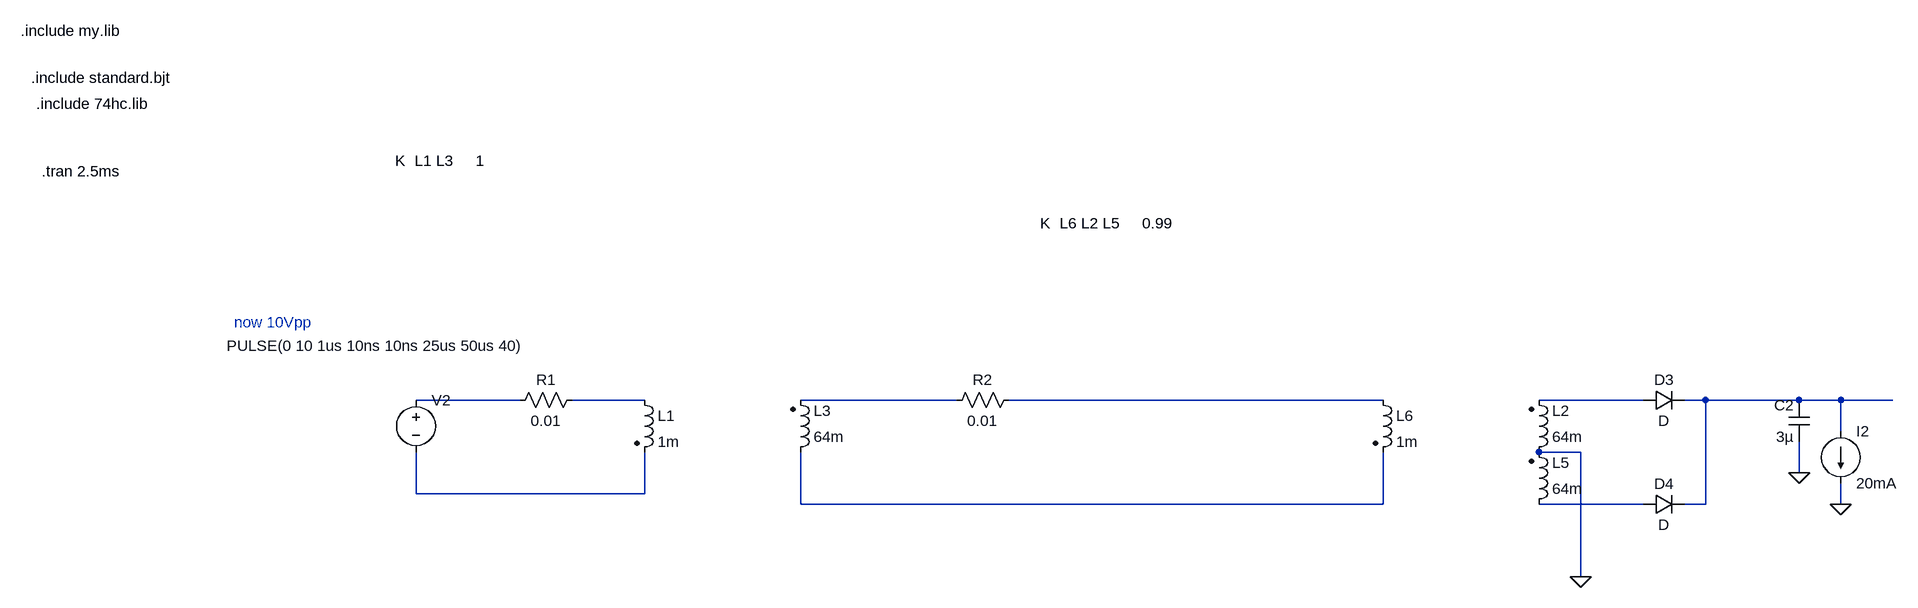
[diagram p0: schematic Draft200.asc]
Draft200.asc, the LTspice schematic file:
Version 4
SHEET 1 5720 1740
WIRE 1312 -128 1152 -128
WIRE 1504 -128 1392 -128
WIRE 1984 -128 1744 -128
WIRE 2640 -128 2064 -128
WIRE 3040 -128 2880 -128
WIRE 3136 -128 3104 -128
WIRE 3280 -128 3136 -128
WIRE 3344 -128 3280 -128
WIRE 3424 -128 3344 -128
WIRE 3344 -80 3344 -128
WIRE 2944 -48 2880 -48
WIRE 3280 -16 3280 -64
WIRE 1152 16 1152 -48
WIRE 1504 16 1504 -48
WIRE 1504 16 1152 16
WIRE 1744 32 1744 -48
WIRE 2640 32 2640 -48
WIRE 2640 32 1744 32
WIRE 3040 32 2880 32
WIRE 3136 32 3136 -128
WIRE 3136 32 3104 32
WIRE 3344 32 3344 0
WIRE 2944 144 2944 -48
FLAG 2944 144 0
FLAG 3280 -16 0
FLAG 3344 32 0
SYMBOL ind2 1728 -32 M180
WINDOW 0 36 80 Left 2
WINDOW 3 36 40 Left 2
SYMATTR InstName L3
SYMATTR Value 64m
SYMATTR Type ind
SYMBOL ind2 1488 -144 R0
SYMATTR InstName L1
SYMATTR Value 1m
SYMATTR Type ind
SYMBOL voltage 1152 -144 R0
WINDOW 123 0 0 Left 0
WINDOW 39 0 0 Left 0
WINDOW 3 -291 -68 Left 2
SYMATTR Value PULSE(0 10 1us 10ns 10ns 25us 50us 40)
SYMATTR InstName V2
SYMBOL res 1408 -144 R90
WINDOW 0 0 56 VBottom 2
WINDOW 3 32 56 VTop 2
SYMATTR InstName R1
SYMATTR Value 0.01
SYMBOL ind2 2864 -32 M180
WINDOW 0 36 80 Left 2
WINDOW 3 36 40 Left 2
SYMATTR InstName L2
SYMATTR Value 64m
SYMATTR Type ind
SYMBOL ind2 2864 48 M180
WINDOW 0 36 80 Left 2
WINDOW 3 36 40 Left 2
SYMATTR InstName L5
SYMATTR Value 64m
SYMATTR Type ind
SYMBOL ind2 2624 -144 R0
SYMATTR InstName L6
SYMATTR Value 1m
SYMATTR Type ind
SYMBOL cap 3296 -64 R180
WINDOW 0 24 56 Left 2
WINDOW 3 24 8 Left 2
SYMATTR InstName C2
SYMATTR Value 3µ
SYMBOL current 3344 -80 R0
WINDOW 123 0 0 Left 0
WINDOW 39 0 0 Left 0
SYMATTR InstName I2
SYMATTR Value 20mA
SYMBOL diode 3040 -112 R270
WINDOW 0 32 32 VTop 2
WINDOW 3 0 32 VBottom 2
SYMATTR InstName D3
SYMBOL diode 3040 48 R270
WINDOW 0 32 32 VTop 2
WINDOW 3 0 32 VBottom 2
SYMATTR InstName D4
SYMBOL res 2080 -144 R90
WINDOW 0 0 56 VBottom 2
WINDOW 3 32 56 VTop 2
SYMATTR InstName R2
SYMATTR Value 0.01
TEXT 576 -480 Left 2 !.tran 2.5ms
TEXT 1120 -496 Left 2 !K  L1 L3     1
TEXT 560 -624 Left 2 !.include standard.bjt
TEXT 544 -696 Left 2 !.include my.lib
TEXT 568 -584 Left 2 !.include 74hc.lib
TEXT 872 -248 Left 2 ;now 10Vpp
TEXT 2112 -400 Left 2 !K  L6 L2 L5     0.99

The netlist it stands for:
* Draft200.asc
L3 N008 N003 64m
L1 N002 N007 1m
V2 N001 N007 PULSE(0 10 1us 10ns 10ns 25us 50us 40)
R1 N002 N001 0.01
L2 0 N005 64m
L5 N009 0 64m
L6 N004 N008 1m
C2 0 N006 3µ
I2 N006 0 20mA
D3 N005 N006 D
D4 N009 N006 D
R2 N004 N003 0.01
.model D D
.lib standard.dio
.tran 2.5ms
K  L1 L3     1
.include standard.bjt
.include my.lib
.include 74hc.lib
* now 10Vpp
K  L6 L2 L5     0.99
.backanno
.end